# Altium schematic sheet Servos.SchDoc
size A; SheetNumber: 8
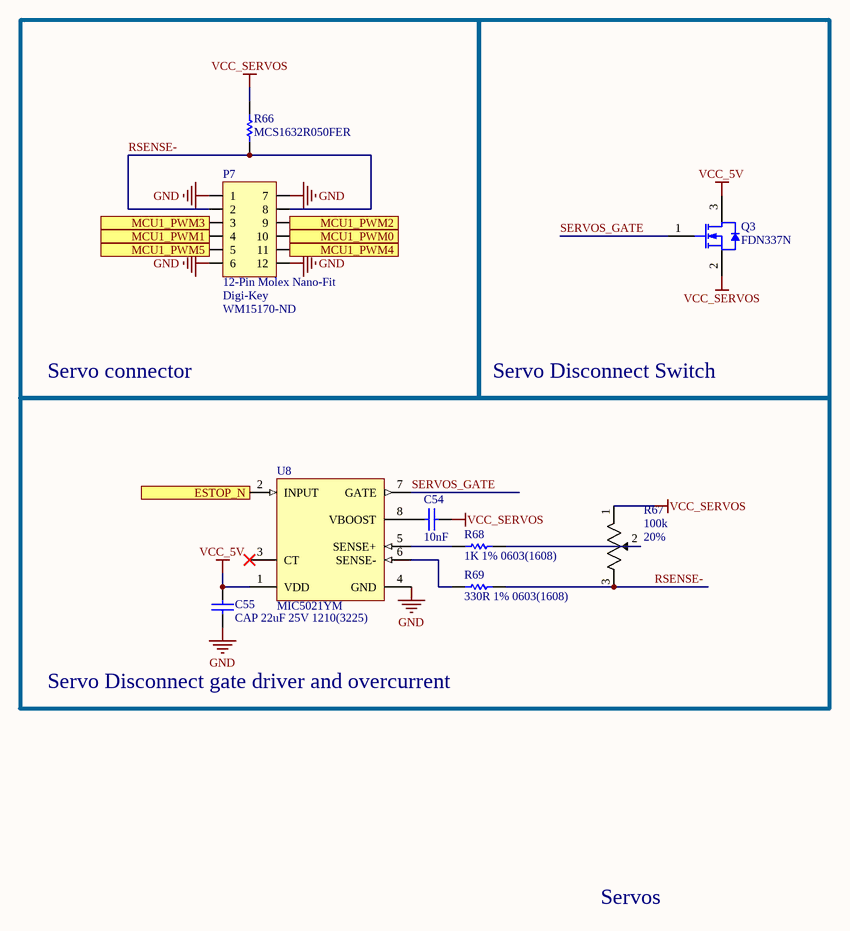
[diagram p0: Servos.SchDoc]

## Parts
C54  10nF  [CAPC0603(1608)100_N]
C55  CAP 22uF 25V 1210(3225)  [CAPC1210(3225)220_N]
P7  12-Pin Molex Nano-Fit  Supplier 1: Digi-Key  Supplier Part Number 1: WM15170-ND  [MOLEX NANO-FIT 2X6 - Right Angle]
Q3  FDN337N  [FAIR-SSOT3L-3_V]
R66  MCS1632R050FER  [RESC3216X62X50LL20T20]
R67  value 100k  Tolerance: 20%  [TT BI 22A TRIM POT]  (hidden comment: 22AR100KLFTR)
R68  1K 1% 0603(1608)  [RESC0603(1608)_N]
R69  330R 1% 0603(1608)  [RESC0603(1608)_N]
U8  MIC5021YM  [MICL-SOICN-8LD-PL-1_V]

## Blocks framed on the sheet
Servo connector: P7 R66
Servo Disconnect Switch: Q3
Servo Disconnect gate driver and overcurrent: C54 C55 R67-R69 U8

## Ports
ESTOP_N, MCU1_PWM0 (in), MCU1_PWM1 (in), MCU1_PWM2 (in), MCU1_PWM3 (in), MCU1_PWM4 (in), MCU1_PWM5 (in)

## Nets
GND: C55.1 P7.1 P7.6 P7.7 P7.12 U8.4(GND)
VCC_5V: C55.2 Q3.3(D) U8.1(VDD)
VCC_SERVOS: C54.2 Q3.2(S) R66.2 R67.1
ESTOP_N: U8.2(INPUT) ; port ESTOP_N
MCU1_PWM0: P7.10 ; port MCU1_PWM0
MCU1_PWM1: P7.4 ; port MCU1_PWM1
MCU1_PWM2: P7.9 ; port MCU1_PWM2
MCU1_PWM3: P7.3 ; port MCU1_PWM3
MCU1_PWM4: P7.11 ; port MCU1_PWM4
MCU1_PWM5: P7.5 ; port MCU1_PWM5
RSENSE-: P7.2 P7.8 R66.1 R67.3 R69.2
SERVOS_GATE: Q3.1(G) U8.7(GATE)
NetC54_1: C54.1 U8.8(VBOOST)
NetR67_2: R67.2 R68.2
NetR68_1: R68.1 U8.5(SENSE+)
NetR69_1: R69.1 U8.6(SENSE-)

Not connected (* = marked no-connect by the designer): U8 3(CT)*

## Notes on the sheet
- Servos

## Library data of the parts
C54 = CMP-1035-02315-1: CAP 10nF 25V ±2% 0603 (1608 Metric) Thickness 1mm SMD; Tolerance: Â±2%; Case-Metric: 1608; Case-EIA: 0603; Rated Voltage: 25 V; Technology: SMT; Max Thickness: 1 mm; Value: 10nF
C55 = CMP-1038-02286-1: CAP 22uF 25V -20% to +80% 1210 (3225 Metric) Thickness 2.2mm SMD; Case-Metric: 3225; Case-EIA: 1210; Rated Voltage: 25 V; Technology: SMT; Max Thickness: 2.2 mm; Value: 22uF; Tolerance: -20% to +80%
P7 = 12-Pin 2-Row Nano-Fit: NanoFit RA Hdr TH DR 12Ckt; ComponentLink1Description: Digikey Link; ComponentLink1URL: https://www.digikey.com/product-detail/en/molex-llc/1053141312/WM15170-ND/6164259
Q3 = CMP-2000-06250-1: N-Channel Logic Level Enhancement Mode Field Effect Transistor,2.2 A, 30 V, -55 to 150 degC, 3-Pin SOT-23, RoHS, Tape and Reel; Manufacturer: Fairchild Semiconductor; Transistor Polarity: NChannel; RDS(on): 0.082Ohm; External Depth: 2.5mm; Reel Quantity: 3000; Threshold Voltage Vgs Typ: 700mV; Current Id Max: 2.2A; External Length / Height: 1.12mm; No. of Pins: 3; Vgss: +/-8V; Voltage Vgs Rds on Measurement: 4.5V; Power Dissipation Pd: 500mW; Full Power Rating Temperature: 25°C; Pulse Current Idm: 10A; Vdss: 30V; Continuous Drain Current Id: 2.5A; SMD Marking: 337; No. of Transistors: 1; SVHC: NoSVHC(19-Dec-2012); Package Version: Rev. 3, 05/2015; Vth: 0.7V; Drain Source Voltage Vds: 20V; On Resistance Rds(on): 52mohm; Trr: 10ns; External Width: 3.05mm; Operating Temperature Range: -55°Cto+150°C; Operating Temperature Min: -55°C; Package / Case: SOT-23; Operating Temperature Max: 150°C; Manufacturer URL: https://www.fairchildsemi.com/; Id: 2.2A; Mounting Technology: SurfaceMount; Rds(on) Test Voltage Vgs: 4.5V; Voltage Vds Typ: 30V; Datasheet Version: Rev. C, 03/1998; Transistor Case Style: SOT-23; Termination Type: SMD; Package Reference: SSOT3L; Package Description: 3-Pin Small Outline Transistor, Body 2.92 x 1.4 mm, Pitch 0.95 mm; Voltage Vgs Max: 700mV; Tape Width: 8mm; Datasheet URL: https://www.fairchildsemi.com/datasheets/FD/FDN337N.pdf; Package URL: https://www.fairchildsemi.com/package-drawings/MA/MA03B.pdf; Current Temperature: 25°C
R66 = CMP-1678-00004-1: Chip Resistor, 0.05 Ohm, +/- 1%, 1 W, -55 to 155 degC, 1206 (3216 Metric), RoHS, Tape and Reel; Frequency: 12 MHz; Resistance: 60 Ohm; Frequency Tolerance: 30ppm; Load Capacitance: 20 pF; Tolerance: 50ppm; Capacitance: 2E-11 f; Length: 11.35 mm; ComponentLink2URL: http://www.ohmite.com/cat/res_mcs.pdf; Mount: Through Hole; ComponentLink2Description: Datasheet; Radiation Hardening: No; ESR: 60 Ohm; ComponentLink1URL: http://www.ohmite.com/; PackageReference: 1206; Package Quantity: 100; DatasheetVersion: Nov-16; REACH SVHC: No SVHC; Width: 4.65 mm; Max Operating Temperature: 70 degC; ComponentLink1Description: Manufacturer URL; Min Operating Temperature: -20 degC; RoHSCompliant: true; Packaging: Bulk; PackageDescription: 2-Pin Surface Mount Device, Body 3.2 x 1.6 mm; Pins: 2; Height: 3.6 mm
R67 = TT 22AR Trim Pot: TT Electronics BI 22AR100KLFTR SMT trim pot, 100k 20%; Supplier 1: Digi-Key; Supplier Part Number 1: 987-1003-1-ND; Datasheet: http://www.bitechnologies.com/pdfs/22.pdf
R68 = CMP-1012-00510-1: 1K 0.1W 1% 0603 (1608 Metric)  SMD; Case-Metric: 1608; Case-EIA: 0603; Value: 1000.00 Ohm; Technology: SMT; Tolerance: 1 %; Power: 0.1 W
R69 = CMP-1012-00454-1: 330R 0.1W 1% 0603 (1608 Metric)  SMD; Case-Metric: 1608; Value: 330.00 Ohm; Case-EIA: 0603; Tolerance: 1 %; Technology: SMT; Power: 0.1 W
U8 = CMP-1558-00003-1: High-Speed High-Side MOSFET Driver, 12 to 36 V, -40 to 85 degC, 8-Pin SOIC, RoHS, Tube; VDD Min: 12 V; VDD Max: 36 V; ComponentLink2Description: Datasheet; Temperature Max: 85 degC; PackageDescription: 8-Pin Small Outline Integrated Package, Body 4.89 x 3.90 mm, Pitch 1.27 mm; ComponentLink1Description: Manufacturer URL; RoHS: TRUE; Temperature Min: -40 degC; ComponentLink2URL: http://www.micrel.com/_PDF/mic5021.pdf; PackageVersion: Rev. A; ComponentLink3Description: Package Specification; PartNumber: MIC5021YM; ComponentLink3URL: http://www.micrel.com/_Packages/SOICN-8LD-PL-1.pdf; Packing: Tube; Mounting Technology: Surface Mount; ComponentLink1URL: http://www.micrel.com/